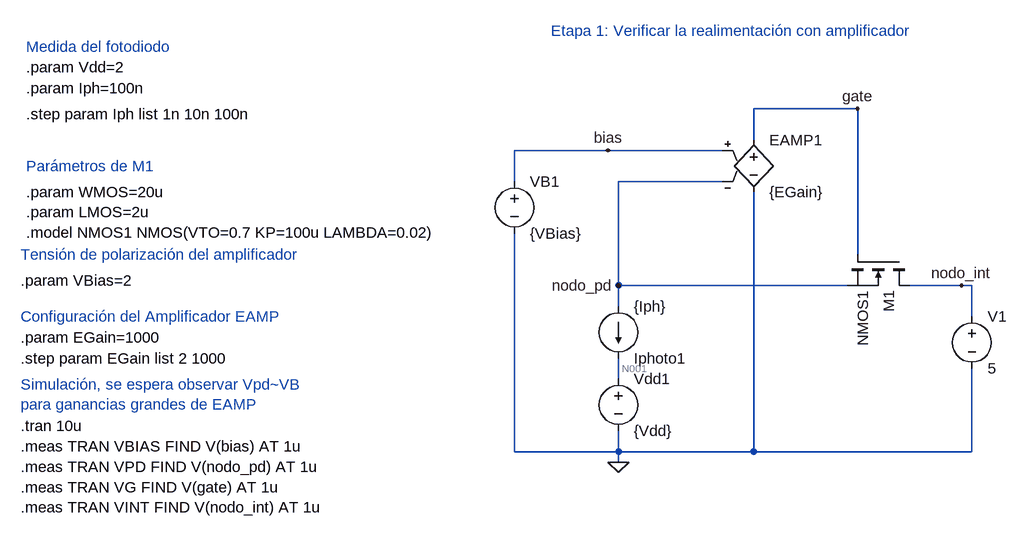
[diagram p0: schematic BDI_Etapa1.asc]
BDI_Etapa1.asc, the LTspice schematic file:
Version 4.1
SHEET 1 880 916
WIRE 304 112 144 112
WIRE 144 160 144 112
WIRE -80 176 -224 176
WIRE 96 176 -80 176
WIRE -224 224 -224 176
WIRE 96 224 -64 224
WIRE 304 336 304 112
WIRE -64 384 -64 224
WIRE 288 384 -64 384
WIRE 464 384 384 384
WIRE 480 384 464 384
WIRE -64 416 -64 384
WIRE 480 432 480 384
WIRE -64 528 -64 496
WIRE -224 640 -224 304
WIRE -64 640 -64 608
WIRE -64 640 -224 640
WIRE 144 640 144 240
WIRE 144 640 -64 640
WIRE 480 640 480 512
WIRE 480 640 144 640
WIRE -64 656 -64 640
FLAG -64 656 0
FLAG 464 384 nodo_int
FLAG -64 384 nodo_pd
FLAG 304 112 gate
FLAG -80 176 bias
DATAFLAG -160 176 ""
DATAFLAG -16 224 ""
DATAFLAG 144 112 ""
SYMBOL e 144 144 R0
SYMATTR InstName EAMP1
SYMATTR Value {EGain}
SYMBOL voltage -224 208 R0
SYMATTR InstName VB1
SYMATTR Value {VBias}
SYMBOL current -64 416 R0
WINDOW 0 24 80 Left 2
WINDOW 3 24 0 Left 2
WINDOW 123 0 0 Left 0
WINDOW 39 0 0 Left 0
SYMATTR InstName Iphoto1
SYMATTR Value {Iph}
SYMBOL nmos 384 336 R90
SYMATTR InstName M1
SYMATTR Value NMOS1
SYMATTR SpiceLine L={LMOS} W={WMOS}
SYMBOL voltage -64 512 R0
SYMATTR InstName Vdd1
SYMATTR Value {Vdd}
SYMBOL voltage 480 416 R0
SYMATTR InstName V1
SYMATTR Value 5
TEXT -168 -8 Left 2 ;Etapa 1: Verificar la realimentación con amplificador
TEXT -976 80 Left 2 !.param Iph=100n
TEXT -976 16 Left 2 ;Medida del fotodiodo
TEXT -976 120 Left 2 !.step param Iph list 1n 10n 100n
TEXT -976 240 Left 2 !.param WMOS=20u\n.param LMOS=2u\n.model NMOS1 NMOS(VTO=0.7 KP=100u LAMBDA=0.02)
TEXT -976 200 Left 2 ;Parámetros de M1
TEXT -984 376 Left 2 !.param VBias=2
TEXT -984 336 Left 2 ;Tensión de polarización del amplificador
TEXT -984 536 Left 2 ;Simulación, se espera observar Vpd~VB \npara ganancias grandes de EAMP
TEXT -984 600 Left 2 !.tran 10u
TEXT -984 632 Left 2 !.meas TRAN VBIAS FIND V(bias) AT 1u\n.meas TRAN VPD FIND V(nodo_pd) AT 1u\n.meas TRAN VG FIND V(gate) AT 1u\n.meas TRAN VINT FIND V(nodo_int) AT 1u
TEXT -976 48 Left 2 !.param Vdd=2
TEXT -984 464 Left 2 !.param EGain=1000
TEXT -984 496 Left 2 !.step param EGain list 2 1000
TEXT -984 432 Left 2 ;Configuración del Amplificador EAMP

The netlist it stands for:
* BDI_Etapa1.asc
EAMP1 gate 0 bias nodo_pd {EGain}
VB1 bias 0 {VBias}
Iphoto1 nodo_pd N001 {Iph}
M1 nodo_int gate nodo_pd nodo_pd NMOS1 L={LMOS} W={WMOS}
Vdd1 N001 0 {Vdd}
V1 nodo_int 0 5
.model NMOS NMOS
.model PMOS PMOS
.lib standard.mos
* Etapa 1: Verificar la realimentación con amplificador
.param Iph=100n
* Medida del fotodiodo
.step param Iph list 1n 10n 100n
.param WMOS=20u
.param LMOS=2u
.model NMOS1 NMOS(VTO=0.7 KP=100u LAMBDA=0.02)
* Parámetros de M1
.param VBias=2
* Tensión de polarización del amplificador
* Simulación, se espera observar Vpd~VB
* para ganancias grandes de EAMP
.tran 10u
.meas TRAN VBIAS FIND V(bias) AT 1u
.meas TRAN VPD FIND V(nodo_pd) AT 1u
.meas TRAN VG FIND V(gate) AT 1u
.meas TRAN VINT FIND V(nodo_int) AT 1u
.param Vdd=2
.param EGain=1000
.step param EGain list 2 1000
* Configuración del Amplificador EAMP
.backanno
.end

* Results of the author's LTspice run, read from the files saved beside the schematic
* Operating Point (first step), zero values left out:
*   V(bias) = 2 V
*   V(gate) = 1.801 V
*   V(n001) = 2 V
*   V(nodo_int) = 5 V
*   V(nodo_pd) = 1.099 V
*   I(Iphoto1) = 1 nA
*   I(V1) = -50 GA
*   I(Vdd1) = 1 nA
*   Ib(M1) = -3.911 pA
*   Id(M1) = 2.609 nA
*   Is(M1) = -2.605 nA
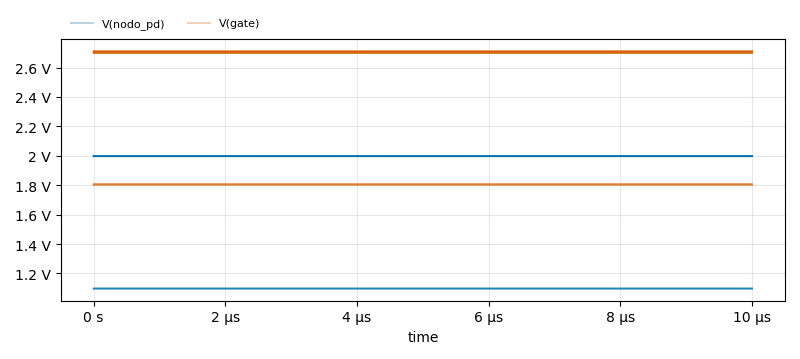
[diagram p1: Transient Analysis of BDI_Etapa1.asc, plotted from the saved traces]
* Transient Analysis, 6 runs:
*   V(nodo_pd) [iph=1e-09 egain=2]: min 1.099 V, max 1.1 V, average 1.1 V, rms 1.1 V, last 1.1 V
*   V(nodo_pd) [iph=1e-08 egain=2]: min 1.099 V, max 1.099 V, average 1.099 V, rms 1.099 V, last 1.099 V
*   V(nodo_pd) [iph=1e-07 egain=2]: min 1.095 V, max 1.095 V, average 1.095 V, rms 1.095 V, last 1.095 V
*   V(nodo_pd) [iph=1e-09 egain=1000]: min 1.997 V, max 1.997 V, average 1.997 V, rms 1.997 V, last 1.997 V
*   V(nodo_pd) [iph=1e-08 egain=1000]: min 1.997 V, max 1.997 V, average 1.997 V, rms 1.997 V, last 1.997 V
*   V(nodo_pd) [iph=1e-07 egain=1000]: min 1.997 V, max 1.997 V, average 1.997 V, rms 1.997 V, last 1.997 V
*   V(gate) [iph=1e-09 egain=2]: min 1.801 V, max 1.801 V, average 1.801 V, rms 1.801 V, last 1.801 V
*   V(gate) [iph=1e-08 egain=2]: min 1.803 V, max 1.803 V, average 1.803 V, rms 1.803 V, last 1.803 V
*   V(gate) [iph=1e-07 egain=2]: min 1.809 V, max 1.809 V, average 1.809 V, rms 1.809 V, last 1.809 V
*   V(gate) [iph=1e-09 egain=1000]: min 2.699 V, max 2.7 V, average 2.699 V, rms 2.699 V, last 2.699 V
*   V(gate) [iph=1e-08 egain=1000]: min 2.702 V, max 2.702 V, average 2.702 V, rms 2.702 V, last 2.702 V
*   V(gate) [iph=1e-07 egain=1000]: min 2.711 V, max 2.711 V, average 2.711 V, rms 2.711 V, last 2.711 V
* From the log:
*   Measurement: vbias
*     step  V(bias)   at
*        1  2  1e-06
*        2  2  1e-06
*        3  2  1e-06
*        4  2  1e-06
*        5  2  1e-06
*        6  2  1e-06
*   Measurement: vpd
*     step  V(nodo_pd)   at
*        1  1.0995477438  1e-06
*        2  1.0985648632  1e-06
*        3  1.09546005726  1e-06
*        4  1.9973013401  1e-06
*        5  1.99729835987  1e-06
*        6  1.99728894234  1e-06
*   Measurement: vg
*     step  V(gate)   at
*        1  1.80090451241  1e-06
*        2  1.8028703928  1e-06
*        3  1.80907988548  1e-06
*        4  2.69867086411  1e-06
*        5  2.70164060593  1e-06
*        6  2.71102428436  1e-06
*   Measurement: vint
*     step  V(nodo_int)   at
*        1  5  1e-06
*        2  5  1e-06
*        3  5  1e-06
*        4  5  1e-06
*        5  5  1e-06
*        6  5  1e-06